# Altium schematic sheet Sata_Drives.SchDoc
size 309 x 209 mm
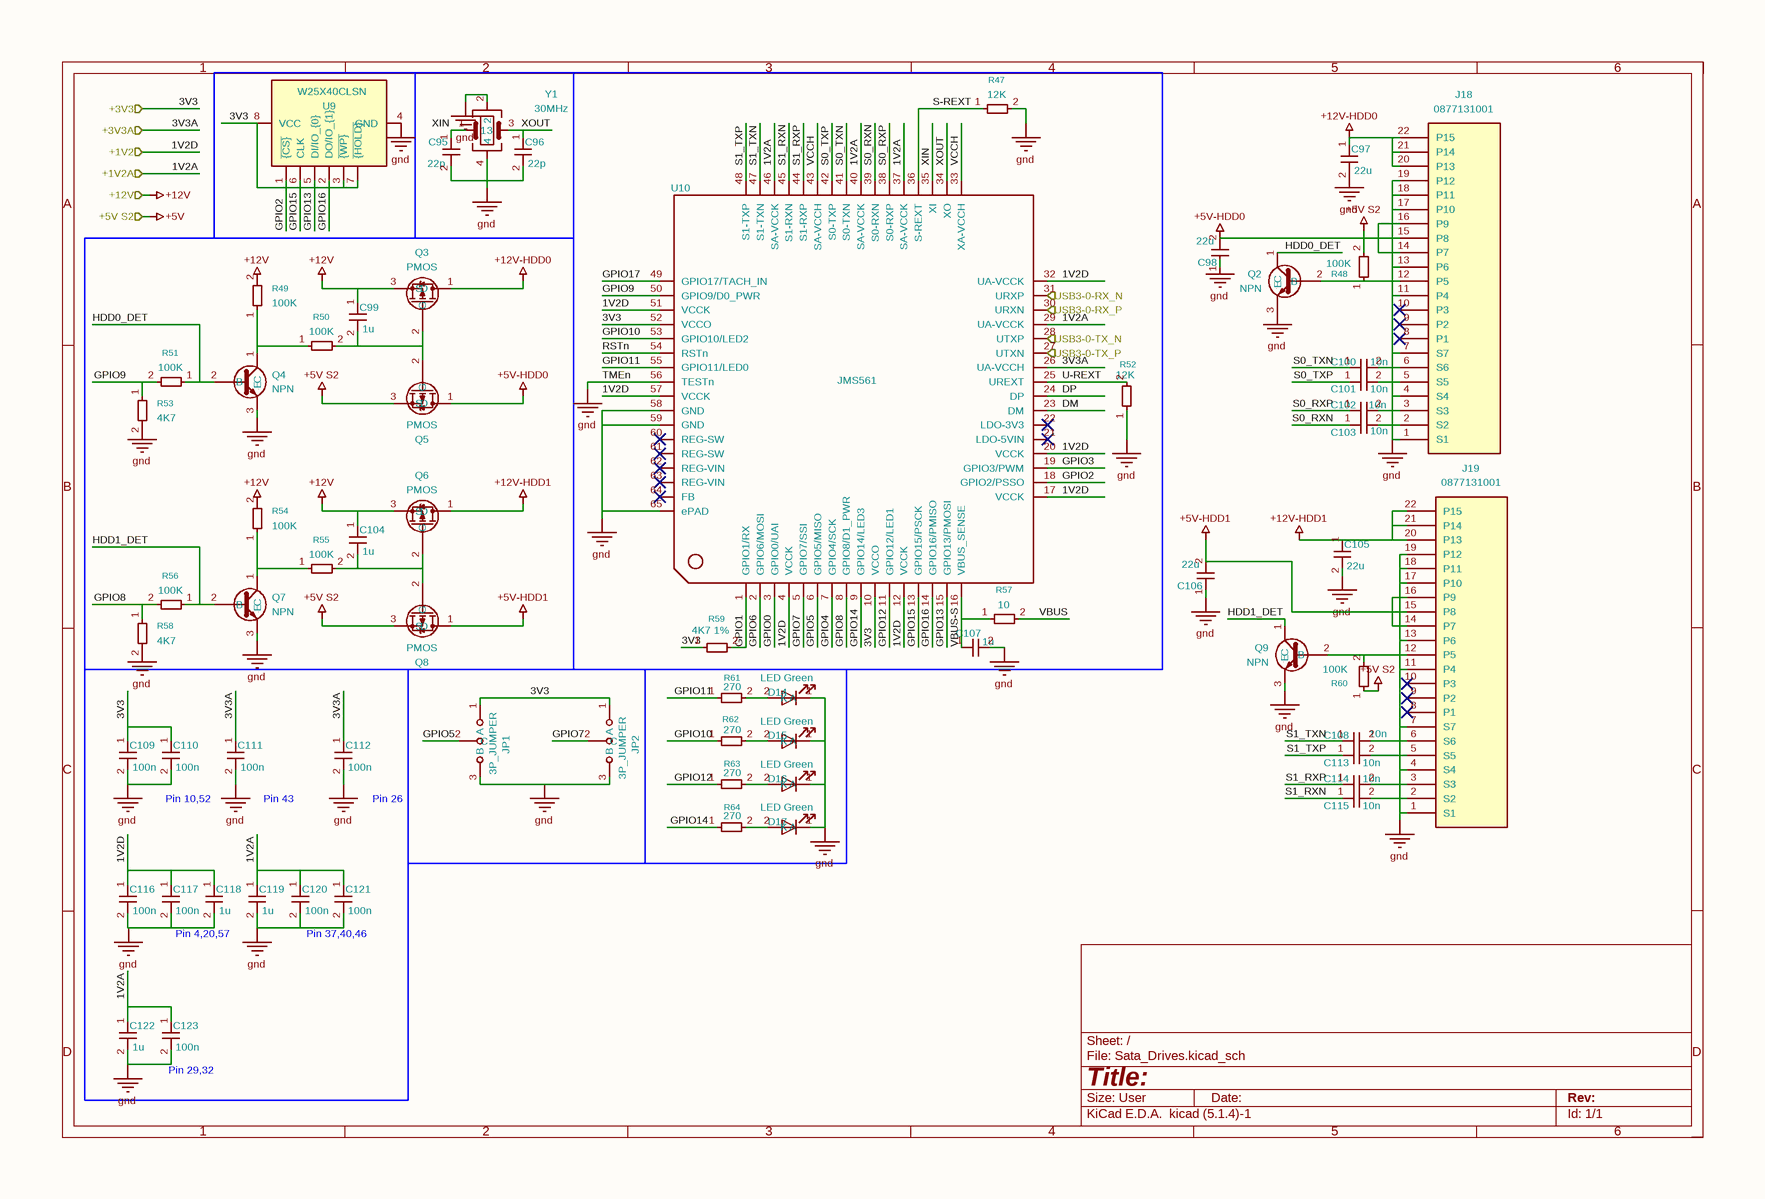
[diagram p0: Sata_Drives.SchDoc]

## Parts
C95  22p  [C_0402_1005Metric]
C96  22p  [C_0402_1005Metric]
C97  22u  [C_1206_3216Metric]
C98  22u  [C_1206_3216Metric]
C99  1u  [C_0805_2012Metric]
C100  10n  [C_0402_1005Metric]
C101  10n  [C_0402_1005Metric]
C102  10n  [C_0402_1005Metric]
C103  10n  [C_0402_1005Metric]
C104  1u  [C_0805_2012Metric]
C105  22u  [C_1206_3216Metric]
C106  22u  [C_1206_3216Metric]
C107  1u  [C_0603_1608Metric]
C108  10n  [C_0402_1005Metric]
C109  100n  [C_0402_1005Metric]
C110  100n  [C_0402_1005Metric]
C111  100n  [C_0402_1005Metric]
C112  100n  [C_0402_1005Metric]
C113  10n  [C_0402_1005Metric]
C114  10n  [C_0402_1005Metric]
C115  10n  [C_0402_1005Metric]
C116  100n  [C_0402_1005Metric]
C117  100n  [C_0402_1005Metric]
C118  1u  [C_0402_1005Metric]
C119  1u  [C_0402_1005Metric]
C120  100n  [C_0402_1005Metric]
C121  100n  [C_0402_1005Metric]
C122  1u  [C_0402_1005Metric]
C123  100n  [C_0402_1005Metric]
D14  LED Green  [LED_0603_1608Metric]
D15  LED Green  [LED_0603_1608Metric]
D16  LED Green  [LED_0603_1608Metric]
D17  LED Green  [LED_0603_1608Metric]
J18  0877131001  [87713-1001]
J19  0877131001  [87713-1001]
JP1  3P_JUMPER  [PinHeader_1x03_P2.54mm_Vertical]
JP2  3P_JUMPER  [PinHeader_1x03_P2.54mm_Vertical]
Q2  NPN  [P200_SOT-23]
Q3  PMOS  [SOT95P237X117-3N]
Q4  NPN  [P200_SOT-23]
Q5  PMOS  [SOT95P237X117-3N]
Q6  PMOS  [SOT95P237X117-3N]
Q7  NPN  [P200_SOT-23]
Q8  PMOS  [SOT95P237X117-3N]
Q9  NPN  [P200_SOT-23]
R47  12K  [R_0603_1608Metric]
R48  100K  [R_0603_1608Metric]
R49  100K  [R_0603_1608Metric]
R50  100K  [R_0603_1608Metric]
R51  100K  [R_0603_1608Metric]
R52  12K  [R_0603_1608Metric]
R53  4K7  [R_0603_1608Metric]
R54  100K  [R_0603_1608Metric]
R55  100K  [R_0603_1608Metric]
R56  100K  [R_0603_1608Metric]
R57  10  [R_0603_1608Metric]
R58  4K7  [R_0603_1608Metric]
R59  4K7 1%  [R_0603_1608Metric]
R60  100K  [R_0603_1608Metric]
R61  270  [R_0603_1608Metric]
R62  270  [R_0603_1608Metric]
R63  270  [R_0603_1608Metric]
R64  270  [R_0603_1608Metric]
U9  W25X40CLSN  [SOIC-8_3.9x4.9mm_P1.27mm]
U10  JMS561  [QFN-64-1EP_8x8mm_P0.4mm_EP6.5x6.5mm_ThermalVias]
Y1  30MHz  [ABM810000MHZ12D2W]

## Ports
+1V2 (in), +1V2A (in), +3V3 (in), +3V3A (in), +5V S2 (in), +12V (in), USB3-0-RX_N (in), USB3-0-RX_P (in), USB3-0-TX_N (out), USB3-0-TX_P (out)

## Nets
+5V: port +5V S2
+5V S2: Q5.3(S) Q8.3(S) R48.2 R60.1
+5V-HDD0: C98.2 J18.14(P7) J18.15(P8) J18.16(P9) Q5.1(D)
+5V-HDD1: C106.2 J19.14(P7) J19.15(P8) J19.16(P9) Q8.1(D)
+12V: C99.1 C104.1 Q3.3(S) Q6.3(S) R49.2 R54.2 ; port +12V
+12V-HDD0: C97.1 J18.20(P13) J18.21(P14) J18.22(P15) Q3.1(D)
+12V-HDD1: C105.1 J19.20(P13) J19.21(P14) J19.22(P15) Q6.1(D)
TMEn: C95.2 C96.2 C97.2 C98.1 C105.2 C106.1 C107.2 C109.2 C110.2 C111.2 C112.2 C116.2 C117.2 C118.2 C119.2 C120.2 C121.2 C122.2 C123.2 D14.1(K) D15.1(K) D16.1(K) D17.1(K) J18.1(S1) J18.4(S4) J18.7(S7) J18.11(P4) J18.13(P6) J18.17(P10) J18.18(P11) J18.19(P12) J19.1(S1) J19.4(S4) J19.7(S7) J19.11(P4) J19.13(P6) J19.17(P10) J19.18(P11) J19.19(P12) JP1.3(B) JP2.3(B) Q2.3(E) Q4.3(E) Q7.3(E) Q9.3(E) R47.2 R52.1 R53.2 R58.2 U9.4(GND) U10.56(TESTn) U10.58(GND) U10.59(GND) U10.65(ePAD) Y1.2 Y1.4  [also labelled gnd]
1V2A: C119.1 C120.1 C121.1 C122.1 C123.1 U10.29(UA-VCCK) U10.37(SA-VCCK) U10.40(SA-VCCK) U10.46(SA-VCCK) ; port +1V2A
1V2D: C116.1 C117.1 C118.1 U10.4(VCCK) U10.12(VCCK) U10.17(VCCK) U10.20(VCCK) U10.32(UA-VCCK) U10.51(VCCK) U10.57(VCCK) ; port +1V2
3V3: C109.1 C110.1 JP1.1(A) JP2.1(A) R59.1 U9.3(~{{WP}}) U9.7(~{{HOLD}}) U9.8(VCC) U10.10(VCCO) U10.52(VCCO) ; port +3V3
3V3A: C111.1 C112.1 U10.26(UA-VCCH) ; port +3V3A
DM: U10.23(DM)
DP: U10.24(DP)
GPIO0: U10.3(GPIO0/UAI)
GPIO1: R59.2 U10.1(GPIO1/RX)
GPIO2: U9.1(~{{CS}}) U10.18(GPIO2/PSSO)
GPIO3: U10.19(GPIO3/PWM)
GPIO4: U10.7(GPIO4/SCK)
GPIO5: JP1.2(C) U10.6(GPIO5/MISO)
GPIO6: U10.2(GPIO6/MOSI)
GPIO7: JP2.2(C) U10.5(GPIO7/SSI)
GPIO8: R56.2 R58.1 U10.8(GPIO8/D1_PWR)
GPIO9: R51.2 R53.1 U10.50(GPIO9/D0_PWR)
GPIO10: R62.1 U10.53(GPIO10/LED2)
GPIO11: R61.1 U10.55(GPIO11/LED0)
GPIO12: R63.1 U10.11(GPIO12/LED1)
GPIO13: U9.5(DI/IO_{0}) U10.15(GPIO13/PMOSI)
GPIO14: R64.1 U10.9(GPIO14/LED3)
GPIO15: U9.6(CLK) U10.13(GPIO15/PSCK)
GPIO16: U9.2(DO/IO_{1}) U10.14(GPIO16/PMISO)
GPIO17: U10.49(GPIO17/TACH_IN)
HDD0_DET: Q2.1(C) Q4.2(B) R51.1
HDD1_DET: Q7.2(B) Q9.1(C) R56.1
RSTn: U10.54(RSTn)
S0_RXN: C103.1 U10.39(S0-RXN)
S0_RXP: C102.1 U10.38(S0-RXP)
S0_TXN: C100.1 U10.41(S0-TXN)
S0_TXP: C101.1 U10.42(S0-TXP)
S1_RXN: C115.1 U10.45(S1-RXN)
S1_RXP: C114.1 U10.44(S1-RXP)
S1_TXN: C108.1 U10.47(S1-TXN)
S1_TXP: C113.1 U10.48(S1-TXP)
S-REXT: R47.1 U10.36(S-REXT)
U-REXT: R52.2 U10.25(UREXT)
USB3-0-RX_N: U10.31(URXP) ; port USB3-0-RX_N
USB3-0-RX_P: U10.30(URXN) ; port USB3-0-RX_P
USB3-0-TX_N: U10.28(UTXP) ; port USB3-0-TX_N
USB3-0-TX_P: U10.27(UTXN) ; port USB3-0-TX_P
VBUS: R57.2
VBUS-S: C107.1 R57.1 U10.16(VBUS_SENSE)
VCCH: U10.33(XA-VCCH) U10.43(SA-VCCH)
XIN: C95.1 U10.35(XI) Y1.1
XOUT: C96.1 U10.34(XO) Y1.3
NetC99_2: C99.2 Q3.2(G) Q5.2(G) R50.2
NetC100_2: C100.2 J18.6(S6)
NetC101_2: C101.2 J18.5(S5)
NetC102_2: C102.2 J18.3(S3)
NetC103_2: C103.2 J18.2(S2)
NetC104_2: C104.2 Q6.2(G) Q8.2(G) R55.2
NetC108_2: C108.2 J19.6(S6)
NetC113_2: C113.2 J19.5(S5)
NetC114_2: C114.2 J19.3(S3)
NetC115_2: C115.2 J19.2(S2)
NetD14_2: D14.2(A) R61.2
NetD15_2: D15.2(A) R62.2
NetD16_2: D16.2(A) R63.2
NetD17_2: D17.2(A) R64.2
NetJ18_12: J18.12(P5) Q2.2(B) R48.1
NetJ19_12: J19.12(P5) Q9.2(B) R60.2
NetQ4_1: Q4.1(C) R49.1 R50.1
NetQ7_1: Q7.1(C) R54.1 R55.1

Not connected (* = marked no-connect by the designer): J18 8(P1)* 9(P2)* 10(P3)*; J19 8(P1)* 9(P2)* 10(P3)*; U10 21(LDO-5VIN)* 22(LDO-3V3)* 60(REG-SW)* 61(REG-SW)* 62(REG-VIN)* 63(REG-VIN)* 64(FB)*

## Notes on the sheet
- Pin 10,52
- Pin 43
- Pin 26
- Pin 4,20,57
- Pin 37,40,46
- (near C123) Pin 29,32
- 1
- 2
- 3
- 4
- 5
- 6
- A
- B
- C
- D
- Title:
- File: Sata_Drives.kicad_sch
- Sheet: /
- KiCad E.D.A.  kicad (5.1.4)-1
- Size: User
- Date:
- Rev:
- Id: 1/1

## Library data of the parts
C95-C123 = C_Small: Description: Unpolarized capacitor, small symbol
  C95 C96: Value: 22p; Footprint: Capacitor_SMD:C_0402_1005Metric
  C97 C98 C105 C106: Value: 22u; Footprint: Capacitor_SMD:C_1206_3216Metric
  C99 C104: Value: 1u; Footprint: Capacitor_SMD:C_0805_2012Metric
  C100-C103 C108 C113-C115: Value: 10n; Footprint: Capacitor_SMD:C_0402_1005Metric
  C107: Value: 1u; Footprint: Capacitor_SMD:C_0603_1608Metric
  C109-C112 C116 C117 C120 C121 C123: Value: 100n; Footprint: Capacitor_SMD:C_0402_1005Metric
  C118 C119 C122: Value: 1u; Footprint: Capacitor_SMD:C_0402_1005Metric
D14-D17 = LED: Part Description: Green 572nm LED Indication - Discrete 2.2V 2-SMD, No Lead; Field4: Digikey; Field5: LTST-S270KGKT; Field6: SML-A12M8TT86N; Field7: Rohm; Field8: 650263301; Value: LED Green; Footprint: LED_SMD:LED_0603_1608Metric
J18 J19 = 0877131001: Manufacturer_Name: Molex; Description: CONN RCPT 22POS STR .05" SMD AU; Manufacturer_Part_Number: 0877131001; Mouser Part Number: N/A; Mouser Price/Stock: https://www.mouser.co.uk/ProductDetail/Molex/0877131001?qs=PBcRNPEHKspplW%252BmhlTGqA%3D%3D; Arrow Part Number: 0877131001; Arrow Price/Stock: https://www.arrow.com/en/products/0877131001/molex?region=nac; Value: 0877131001; Footprint: 87713-1001:87713-1001
JP1 JP2 = Jumper_3_Bridged12: Description: Jumper, 3-pole, pins 1+2 closed/bridged; Value: 3P_JUMPER; Footprint: Connector_PinHeader_2.54mm:PinHeader_1x03_P2.54mm_Vertical
Q2 Q4 Q7 Q9 = NPN: Description: Bipolar transistor symbol for simulation only, substrate tied to the emitter; Sim.Type: GUMMELPOON; Sim.Pins: 1=C 2=B 3=E; Sim.Device: NPN; Value: NPN; Footprint: MMBT3904:P200_SOT-23
Q3 Q5 Q6 Q8 = PMOS: Description: P-MOSFET transistor, drain/source/gate; Sim.Type: VDMOS; Sim.Pins: 1=D 2=G 3=S; Sim.Device: PMOS; Value: PMOS; Footprint: AOSS21311C:SOT95P237X117-3N
R47-R64 = R_Small: Description: Resistor, small symbol; Footprint: Resistor_SMD:R_0603_1608Metric
  R47 R52: Value: 12K
  R48-R51 R54-R56 R60: Value: 100K
  R53 R58: Value: 4K7
  R57: Value: 10
  R59: Value: 4K7 1%
  R61-R64: Value: 270
U9 = W25X40CLSN: Description: 4Mbit / 512KiB Serial Flash memory, Standard/Dual I/O SPI, 2.3-3.6V, SOIC-8 (150 mil); Value: W25X40CLSN; Footprint: Package_SO:SOIC-8_3.9x4.9mm_P1.27mm
U10 = JMS561: Description: JMS561 is a SuperSpeed USB 5Gb/s to dual SATA 6Gb/s bridge controller, which also supports various application configurations.; Value: JMS561; Footprint: Package_DFN_QFN:QFN-64-1EP_8x8mm_P0.4mm_EP6.5x6.5mm_ThermalVias
Y1 = Crystal_GND24: Description: Four pin crystal, GND on pins 2 and 4; Value: 30MHz; Footprint: ABM8-30.000MHZ-B2-T:ABM810000MHZ12D2W